# EAGLE design rpi breakout (EAGLE 9.3.0)
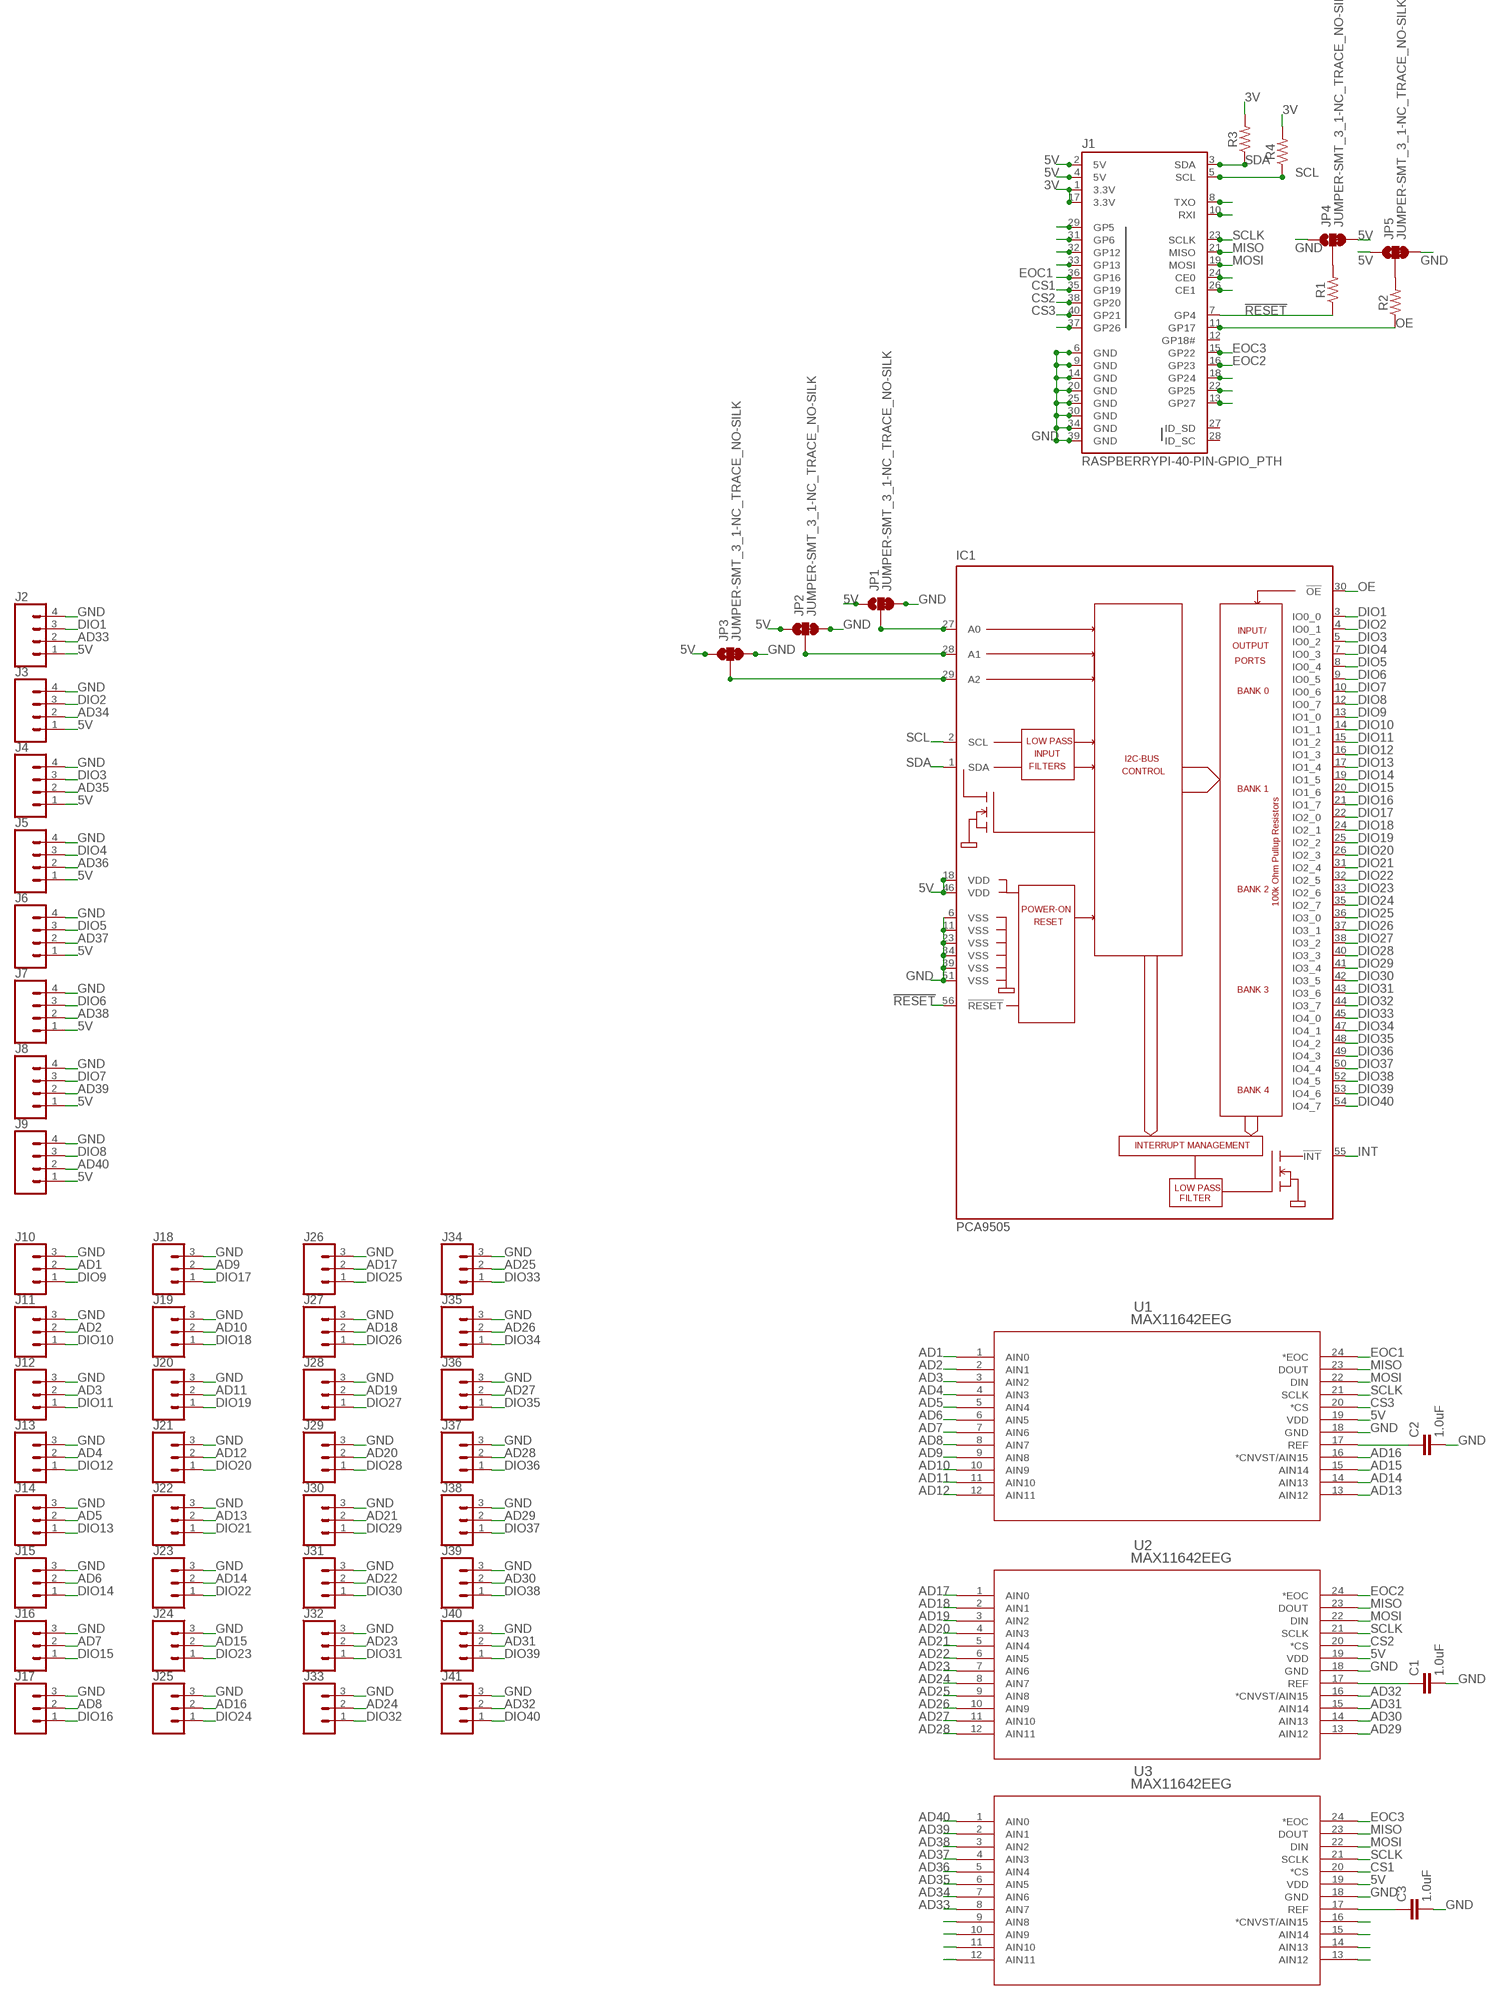
[diagram p0: schematic, sheet 1]

## Parts
C1  1.0uF  1.0UF-0805-25V-10%  [0805]
C2  1.0uF  1.0UF-0805-25V-10%  [0805]
C3  1.0uF  1.0UF-0805-25V-10%  [0805]
IC1  PCA9505  [TSSOP56-6]
J1  RASPBERRYPI-40-PIN-GPIO_PTH  [2X20_SHROUDED]
J2  CONN_04JST-PTH  [JST-4-PTH]
J3  CONN_04JST-PTH  [JST-4-PTH]
J4  CONN_04JST-PTH  [JST-4-PTH]
J5  CONN_04JST-PTH  [JST-4-PTH]
J6  CONN_04JST-PTH  [JST-4-PTH]
J7  CONN_04JST-PTH  [JST-4-PTH]
J8  CONN_04JST-PTH  [JST-4-PTH]
J9  CONN_04JST-PTH  [JST-4-PTH]
J10  CONN_03JST-PTH  [JST-3-PTH]
J11  CONN_03JST-PTH  [JST-3-PTH]
J12  CONN_03JST-PTH  [JST-3-PTH]
J13  CONN_03JST-PTH  [JST-3-PTH]
J14  CONN_03JST-PTH  [JST-3-PTH]
J15  CONN_03JST-PTH  [JST-3-PTH]
J16  CONN_03JST-PTH  [JST-3-PTH]
J17  CONN_03JST-PTH  [JST-3-PTH]
J18  CONN_03JST-PTH  [JST-3-PTH]
J19  CONN_03JST-PTH  [JST-3-PTH]
J20  CONN_03JST-PTH  [JST-3-PTH]
J21  CONN_03JST-PTH  [JST-3-PTH]
J22  CONN_03JST-PTH  [JST-3-PTH]
J23  CONN_03JST-PTH  [JST-3-PTH]
J24  CONN_03JST-PTH  [JST-3-PTH]
J25  CONN_03JST-PTH  [JST-3-PTH]
J26  CONN_03JST-PTH  [JST-3-PTH]
J27  CONN_03JST-PTH  [JST-3-PTH]
J28  CONN_03JST-PTH  [JST-3-PTH]
J29  CONN_03JST-PTH  [JST-3-PTH]
J30  CONN_03JST-PTH  [JST-3-PTH]
J31  CONN_03JST-PTH  [JST-3-PTH]
J32  CONN_03JST-PTH  [JST-3-PTH]
J33  CONN_03JST-PTH  [JST-3-PTH]
J34  CONN_03JST-PTH  [JST-3-PTH]
J35  CONN_03JST-PTH  [JST-3-PTH]
J36  CONN_03JST-PTH  [JST-3-PTH]
J37  CONN_03JST-PTH  [JST-3-PTH]
J38  CONN_03JST-PTH  [JST-3-PTH]
J39  CONN_03JST-PTH  [JST-3-PTH]
J40  CONN_03JST-PTH  [JST-3-PTH]
J41  CONN_03JST-PTH  [JST-3-PTH]
JP1  JUMPER-SMT_3_1-NC_TRACE_NO-SILK  [SMT-JUMPER_3_1-NC_TRACE_NO-SILK]
JP2  JUMPER-SMT_3_1-NC_TRACE_NO-SILK  [SMT-JUMPER_3_1-NC_TRACE_NO-SILK]
JP3  JUMPER-SMT_3_1-NC_TRACE_NO-SILK  [SMT-JUMPER_3_1-NC_TRACE_NO-SILK]
JP4  JUMPER-SMT_3_1-NC_TRACE_NO-SILK  [SMT-JUMPER_3_1-NC_TRACE_NO-SILK]
JP5  JUMPER-SMT_3_1-NC_TRACE_NO-SILK  [SMT-JUMPER_3_1-NC_TRACE_NO-SILK]
R1  RESISTOR0805  [0805]
R2  RESISTOR0805  [0805]
R3  RESISTOR0805  [0805]
R4  RESISTOR0805  [0805]
U1  MAX11642EEG  [21-0055H_24]
U2  MAX11642EEG  [21-0055H_24]
U3  MAX11642EEG  [21-0055H_24]

## Nets
3V: J1.1(3.3V) J1.17(3.3V) R3.2 R4.2
5V: IC1.18(VDD) IC1.46(VDD) J1.2(5V) J1.4(5V) J2.1 J3.1 J4.1 J5.1 J6.1 J7.1 J8.1 J9.1 JP1.1 JP2.1 JP3.1 JP4.3 JP5.1 U1.19(VDD) U2.19(VDD) U3.19(VDD)
!RESET: IC1.56(!RESET) J1.7(GP4) R1.1
AD1: J10.2 U1.1(AIN0)
AD2: J11.2 U1.2(AIN1)
AD3: J12.2 U1.3(AIN2)
AD4: J13.2 U1.4(AIN3)
AD5: J14.2 U1.5(AIN4)
AD6: J15.2 U1.6(AIN5)
AD7: J16.2 U1.7(AIN6)
AD8: J17.2 U1.8(AIN7)
AD9: J18.2 U1.9(AIN8)
AD10: J19.2 U1.10(AIN9)
AD11: J20.2 U1.11(AIN10)
AD12: J21.2 U1.12(AIN11)
AD13: J22.2 U1.13(AIN12)
AD14: J23.2 U1.14(AIN13)
AD15: J24.2 U1.15(AIN14)
AD16: J25.2 U1.16(*CNVST/AIN15)
AD17: J26.2 U2.1(AIN0)
AD18: J27.2 U2.2(AIN1)
AD19: J28.2 U2.3(AIN2)
AD20: J29.2 U2.4(AIN3)
AD21: J30.2 U2.5(AIN4)
AD22: J31.2 U2.6(AIN5)
AD23: J32.2 U2.7(AIN6)
AD24: J33.2 U2.8(AIN7)
AD25: J34.2 U2.9(AIN8)
AD26: J35.2 U2.10(AIN9)
AD27: J36.2 U2.11(AIN10)
AD28: J37.2 U2.12(AIN11)
AD29: J38.2 U2.13(AIN12)
AD30: J39.2 U2.14(AIN13)
AD31: J40.2 U2.15(AIN14)
AD32: J41.2 U2.16(*CNVST/AIN15)
AD33: J2.2 U3.8(AIN7)
AD34: J3.2 U3.7(AIN6)
AD35: J4.2 U3.6(AIN5)
AD36: J5.2 U3.5(AIN4)
AD37: J6.2 U3.4(AIN3)
AD38: J7.2 U3.3(AIN2)
AD39: J8.2 U3.2(AIN1)
AD40: J9.2 U3.1(AIN0)
CS1: J1.35(GP19) U3.20(*CS)
CS2: J1.38(GP20) U2.20(*CS)
CS3: J1.40(GP21) U1.20(*CS)
DIO1: IC1.3(IO0_0) J2.3
DIO2: IC1.4(IO0_1) J3.3
DIO3: IC1.5(IO0_2) J4.3
DIO4: IC1.7(IO0_3) J5.3
DIO5: IC1.8(IO0_4) J6.3
DIO6: IC1.9(IO0_5) J7.3
DIO7: IC1.10(IO0_6) J8.3
DIO8: IC1.12(IO0_7) J9.3
DIO9: IC1.13(IO1_0) J10.1
DIO10: IC1.14(IO1_1) J11.1
DIO11: IC1.15(IO1_2) J12.1
DIO12: IC1.16(IO1_3) J13.1
DIO13: IC1.17(IO1_4) J14.1
DIO14: IC1.19(IO1_5) J15.1
DIO15: IC1.20(IO1_6) J16.1
DIO16: IC1.21(IO1_7) J17.1
DIO17: IC1.22(IO2_0) J18.1
DIO18: IC1.24(IO2_1) J19.1
DIO19: IC1.25(IO2_2) J20.1
DIO20: IC1.26(IO2_3) J21.1
DIO21: IC1.31(IO2_4) J22.1
DIO22: IC1.32(IO2_5) J23.1
DIO23: IC1.33(IO2_6) J24.1
DIO24: IC1.35(IO2_7) J25.1
DIO25: IC1.36(IO3_0) J26.1
DIO26: IC1.37(IO3_1) J27.1
DIO27: IC1.38(IO3_2) J28.1
DIO28: IC1.40(IO3_3) J29.1
DIO29: IC1.41(IO3_4) J30.1
DIO30: IC1.42(IO3_5) J31.1
DIO31: IC1.43(IO3_6) J32.1
DIO32: IC1.44(IO3_7) J33.1
DIO33: IC1.45(IO4_0) J34.1
DIO34: IC1.47(IO4_1) J35.1
DIO35: IC1.48(IO4_2) J36.1
DIO36: IC1.49(IO4_3) J37.1
DIO37: IC1.50(IO4_4) J38.1
DIO38: IC1.52(IO4_5) J39.1
DIO39: IC1.53(IO4_6) J40.1
DIO40: IC1.54(IO4_7) J41.1
EOC1: J1.36(GP16) U1.24(*EOC)
EOC2: J1.16(GP23) U2.24(*EOC)
EOC3: J1.15(GP22) U3.24(*EOC)
GND: C1.2 C2.2 C3.2 IC1.6(VSS) IC1.11(VSS) IC1.23(VSS) IC1.34(VSS) IC1.39(VSS) IC1.51(VSS) J1.6(GND) J1.9(GND) J1.14(GND) J1.20(GND) J1.25(GND) J1.30(GND) J1.34(GND) J1.39(GND) J2.4 J3.4 J4.4 J5.4 J6.4 J7.4 J8.4 J9.4 J10.3 J11.3 J12.3 J13.3 J14.3 J15.3 J16.3 J17.3 J18.3 J19.3 J20.3 J21.3 J22.3 J23.3 J24.3 J25.3 J26.3 J27.3 J28.3 J29.3 J30.3 J31.3 J32.3 J33.3 J34.3 J35.3 J36.3 J37.3 J38.3 J39.3 J40.3 J41.3 JP1.3 JP2.3 JP3.3 JP4.1 JP5.3 U1.18(GND) U2.18(GND) U3.18(GND)
INT: IC1.55(!INT)
MISO: J1.21(MISO) U1.23(DOUT) U2.23(DOUT) U3.23(DOUT)
MOSI: J1.19(MOSI) U1.22(DIN) U2.22(DIN) U3.22(DIN)
N$1: JP4.2 R1.2
N$2: C3.1 U3.17(REF)
N$3: C1.1 U2.17(REF)
N$4: JP5.2 R2.2
N$5: J1.29(GP5)
N$6: J1.31(GP6)
N$7: J1.32(GP12)
N$8: J1.33(GP13)
N$11: C2.1 U1.17(REF)
N$13: J1.37(GP26)
N$17: IC1.27(A0) JP1.2
N$18: IC1.28(A1) JP2.2
N$19: IC1.29(A2) JP3.2
N$24: J1.8(TXO)
N$25: J1.10(RXI)
N$29: J1.24(CE0)
N$30: J1.26(CE1)
N$36: J1.18(GP24)
N$37: J1.22(GP25)
N$40: U3.9(AIN8)
N$41: U3.10(AIN9)
N$42: U3.11(AIN10)
N$43: U3.12(AIN11)
N$52: U3.16(*CNVST/AIN15)
N$53: U3.14(AIN13)
N$54: U3.15(AIN14)
N$55: U3.13(AIN12)
OE: IC1.30(!OE) J1.11(GP17) R2.1
SCL: IC1.2(SCL) J1.5(SCL) R4.1
SCLK: J1.23(SCLK) U1.21(SCLK) U2.21(SCLK) U3.21(SCLK)
SDA: IC1.1(SDA) J1.3(SDA) R3.1
SDA1: J1.13(GP27)
Unconnected: J1.12(GP18#) J1.27(ID_SD) J1.28(ID_SC)

## Library data of the parts
C1-C3 = SparkFun-Capacitors:1.0UF: 1µF ceramic capacitors A capacitor is a passive two-terminal electrical component used to store electrical energy temporarily in an electric field.; PROD_ID: CAP-08064
IC1 = micro-philips:PCA9505: 40-bit I2C-bus I/O port with /RESET, /OE and /INT The 9505 has 100k ohm pull-ups on IO pins. Source: http://www.nxp.com/acrobat_download/datasheets/PCA9505_9506_3.pdf; MPN: PCA9505DGG,118; OC_FARNELL: unknown; OC_NEWARK: 70R6450
J1 = SparkFun-Connectors:RASPBERRYPI-40-PIN-GPIO: Raspberry Pi GPIO Header 2x20 pin connector, as found on B, B+, A+ models. Both shrouded PTH and SMT versions available. SparkFun Products: GPIO Shrouded Header <https://www.sparkfun.com/products/13054>- PTH SparkFun Pi Wedge (Preassembled) <https://www.sparkfun.com/products/13717>; PROD_ID: CONN-12263; SF_ID: PRT-13054
J2-J9 = SparkFun-Connectors:CONN_04: Multi connection point. Often used as Generic Header-pin footprint for 0.1 inch spaced/style header connections On any of the 0.1 inch spaced packages, you can populate with these: Break Away Headers - Straight <https://www.sparkfun.com/products/116> (PRT-00116) Break Away Male Headers - Right Angle <https://www.sparkfun.com/products/553> (PRT-00553) Female Headers <https://www.sparkfun.com/products/115> (PRT-00115) Break Away Headers - Machine Pin <https://www.sparkfun.com/products/117> (PRT-00117) Break Away Female Headers - Swiss Machine Pin <https://www.sparkfun.com/products/743> (PRT-00743) For SCREWTERMINALS and SPRING TERMINALS visit here: Screw Terimnals on SparkFun.com <https://www.sparkfun.com/search/results?term=Screw+Terminals> (5mm/3.5mm/2.54mm spacing) This device is also useful as a general connection point to wire up your design to another part of your project. Our various solder wires solder well into these plated through hole pads. Hook-Up Wire - Assortment (Stranded, 22 AWG) <https://www.sparkfun.com/products/11375> (PRT-11375) Hook-Up Wire - Assortment (Solid Core, 22 AWG) <https://www.sparkfun.com/products/11367> (PRT-11367) View the entire wire category on our website here <https://www.sparkfun.com/categories/141> Special notes: Molex polarized connector foot print use with SKU : PRT-08231 with associated crimp pins and housings. 1MM SMD Version SKU: PRT-10208; PROD_ID: WIRE-13531; SF_ID: PRT-09916
J10-J41 = SparkFun-Connectors:CONN_03: Multi connection point. Often used as Generic Header-pin footprint for 0.1 inch spaced/style header connections On any of the 0.1 inch spaced packages, you can populate with these: Break Away Headers - Straight <https://www.sparkfun.com/products/116> (PRT-00116) Break Away Male Headers - Right Angle <https://www.sparkfun.com/products/553> (PRT-00553) Female Headers <https://www.sparkfun.com/products/115> (PRT-00115) Break Away Headers - Machine Pin <https://www.sparkfun.com/products/117> (PRT-00117) Break Away Female Headers - Swiss Machine Pin <https://www.sparkfun.com/products/743> (PRT-00743) Stackable Header - 3 Pin (Female, 0.1") <https://www.sparkfun.com/products/13875> (PRT-13875) For SCREWTERMINALS and SPRING TERMINALS visit here: Screw Terimnals on SparkFun.com <https://www.sparkfun.com/search/results?term=Screw+Terminals> (5mm/3.5mm/2.54mm spacing) This device is also useful as a general connection point to wire up your design to another part of your project. Our various solder wires solder well into these plated through hole pads. Hook-Up Wire - Assortment (Stranded, 22 AWG) <https://www.sparkfun.com/products/11375> (PRT-11375) Hook-Up Wire - Assortment (Solid Core, 22 AWG) <https://www.sparkfun.com/products/11367> (PRT-11367) View the entire wire category on our website here <https://www.sparkfun.com/categories/141> Special notes: Molex polarized connector foot print use with SKU : PRT-08232 with associated crimp pins and housings.; PROD_ID: WIRE-10037; SF_ID: PRT-09915
JP1-JP5 = SparkFun-Jumpers:JUMPER-SMT_3_1-NC_TRACE: Normally closed trace jumper (1 of 2 connections) This jumper has a trace between two pads so it's normally closed (NC). The other connection is normally open (NO). Use a razor knife to open the connection. For best results follow the IPC guidelines for cutting traces: Cutout at least 0.063 mm (0.005 in). Remove all loose material to clean up the cut area. Seal the cut with an approved epoxy. Reapply solder to reclose the connection, or to close the NO connection.
R1-R4 = SparkFun-Resistors:RESISTOR: Generic Resistor Package
U1-U3 = MAX11642EEG:MAX11642EEG; AVAILABILITY: Unavailable; DESCRIPTION: ADC Single SAR 300ksps 8-bit Serial 24-Pin QSOP T/R; MF: Maxim Integrated; MP: MAX11642EEG+T; PACKAGE: QSOP-24 Maxim Integrated; PRICE: None

## Board
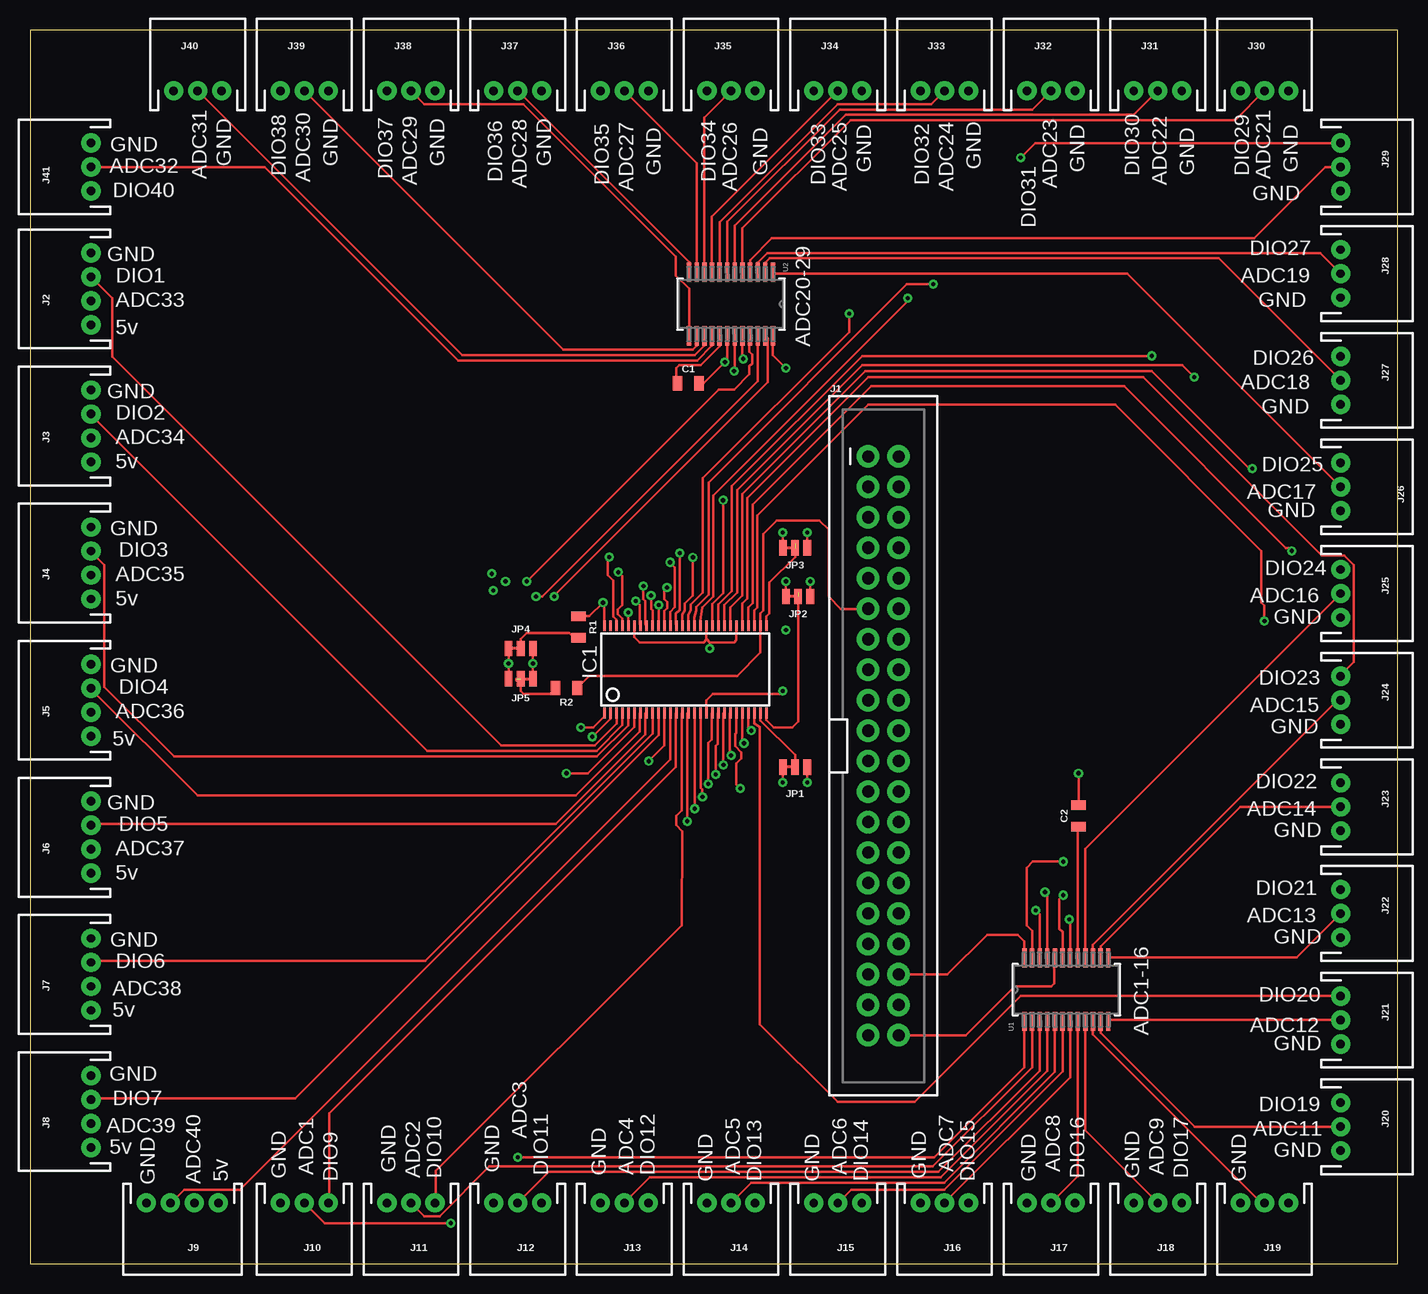
[diagram p1: board, top side]
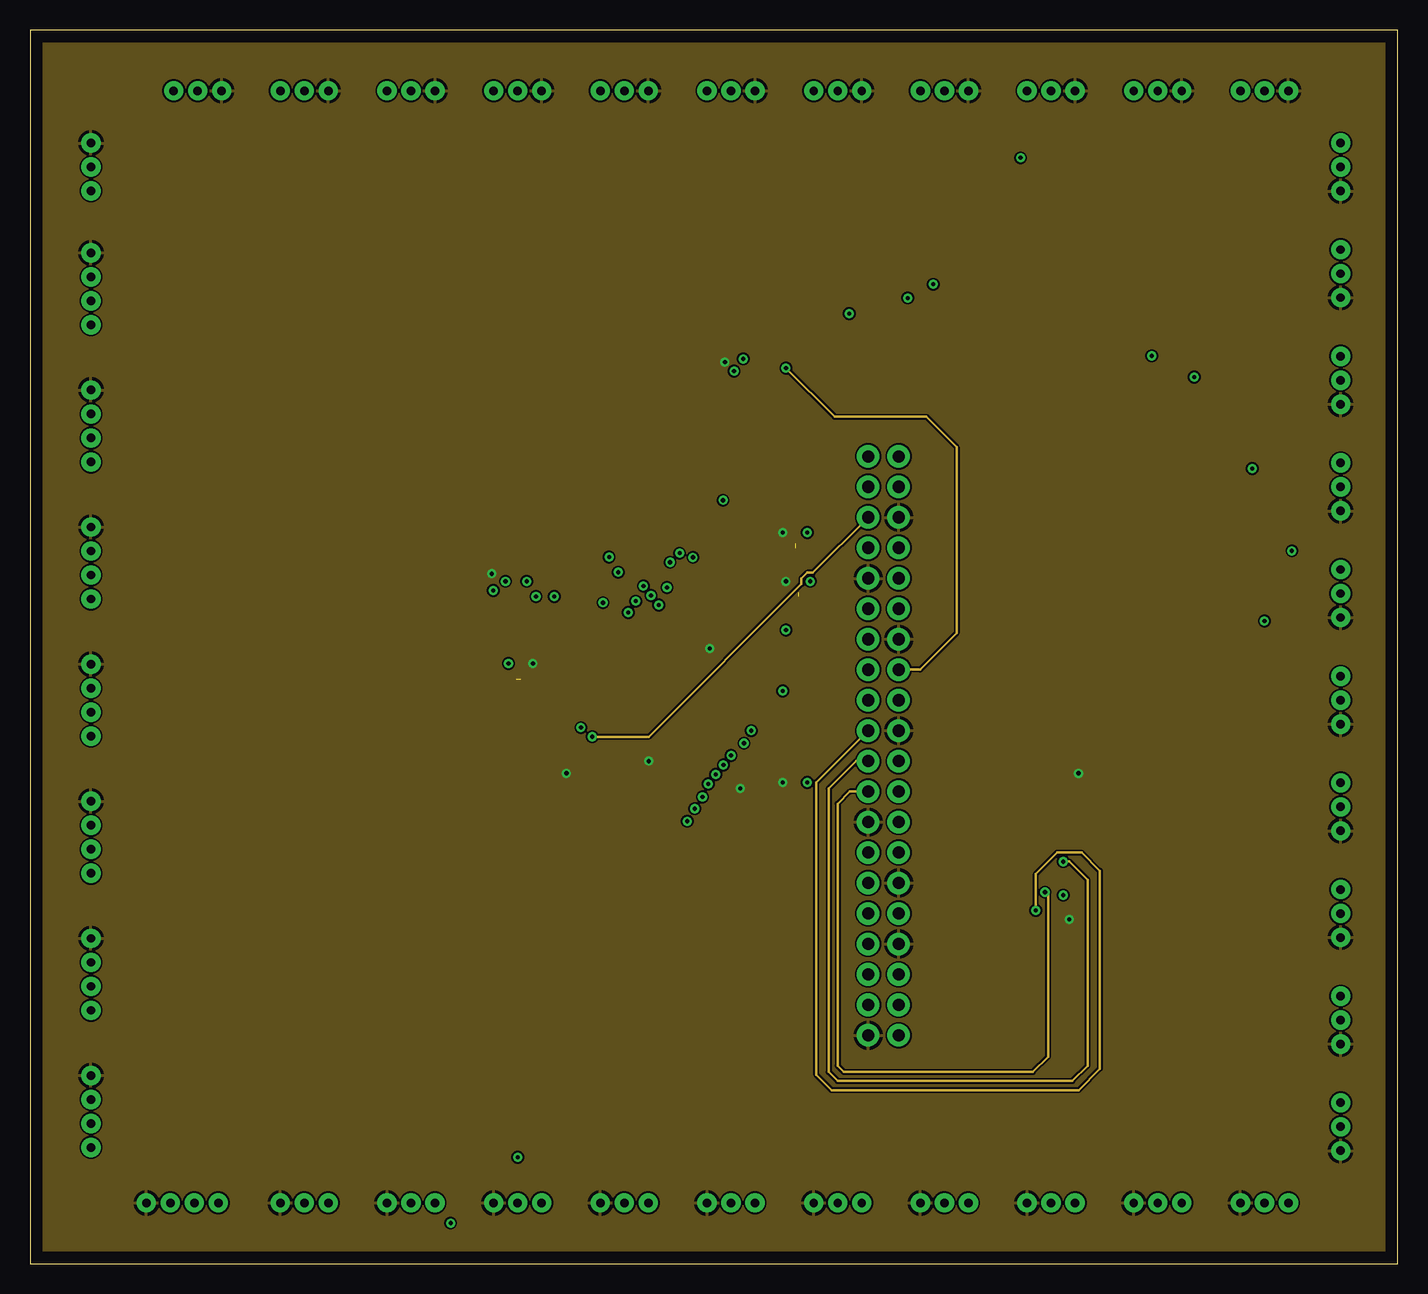
[diagram p2: board, inner layer Route2]
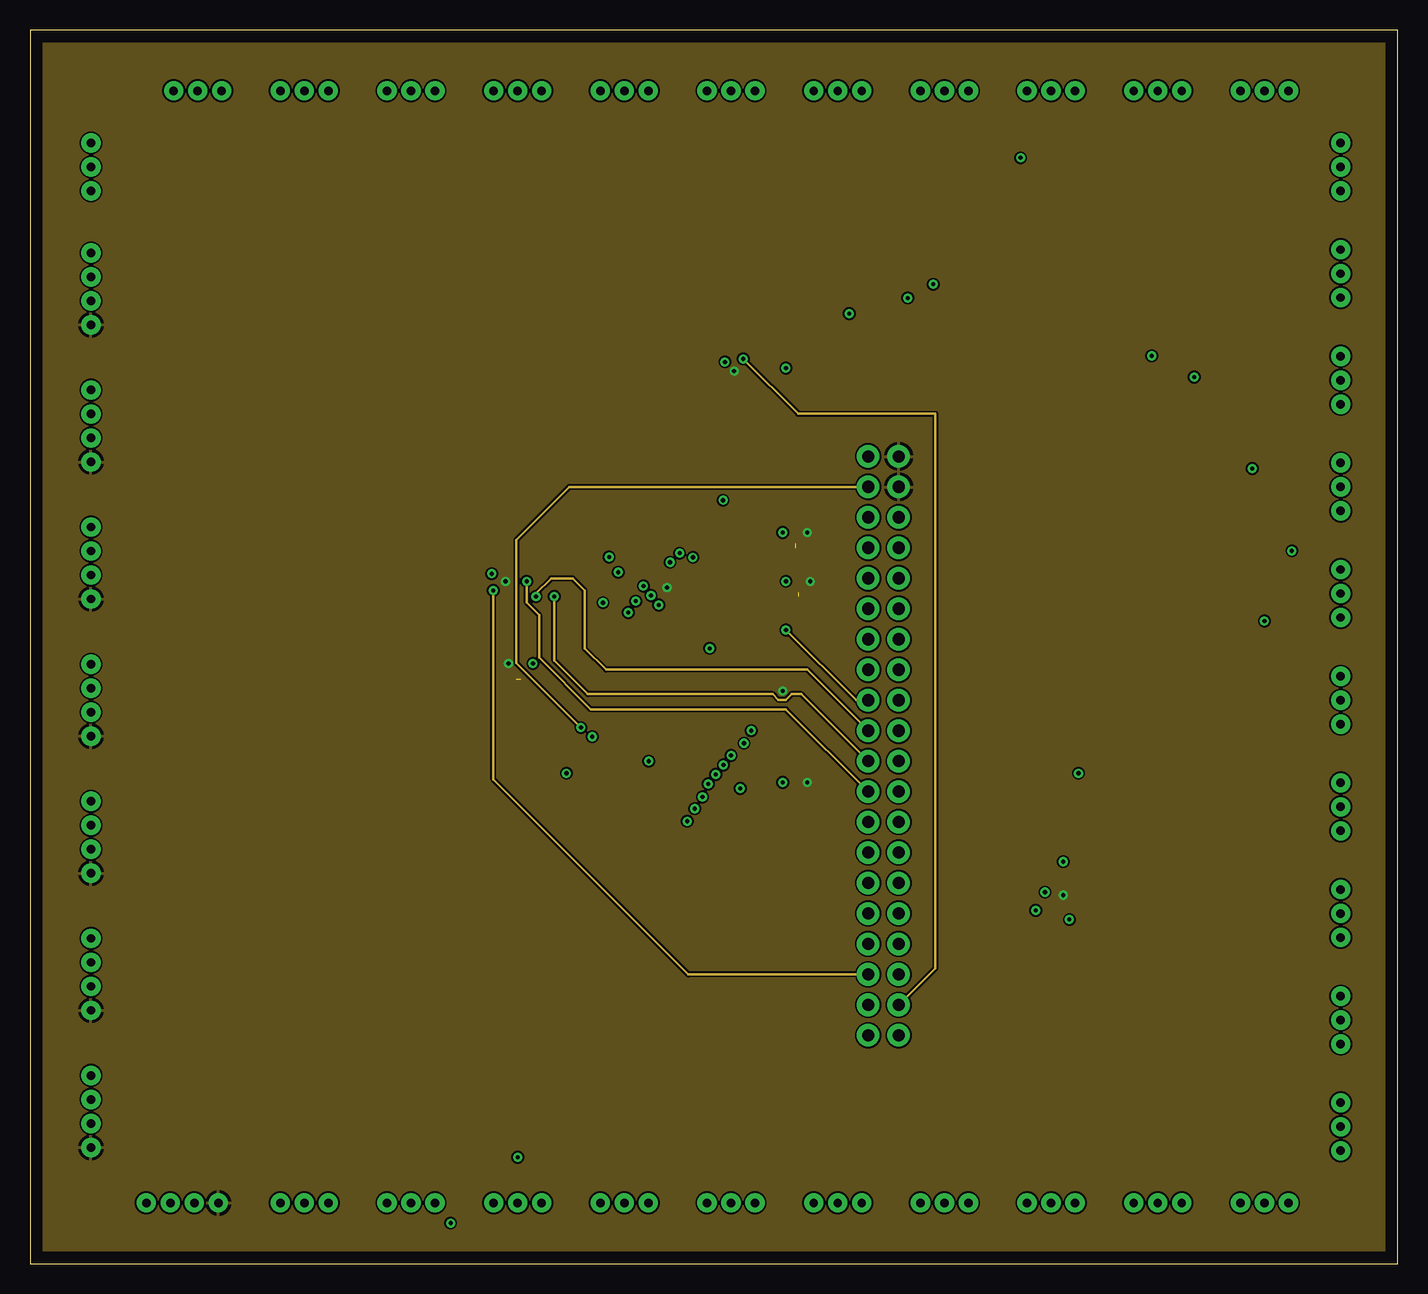
[diagram p3: board, inner layer Route15]
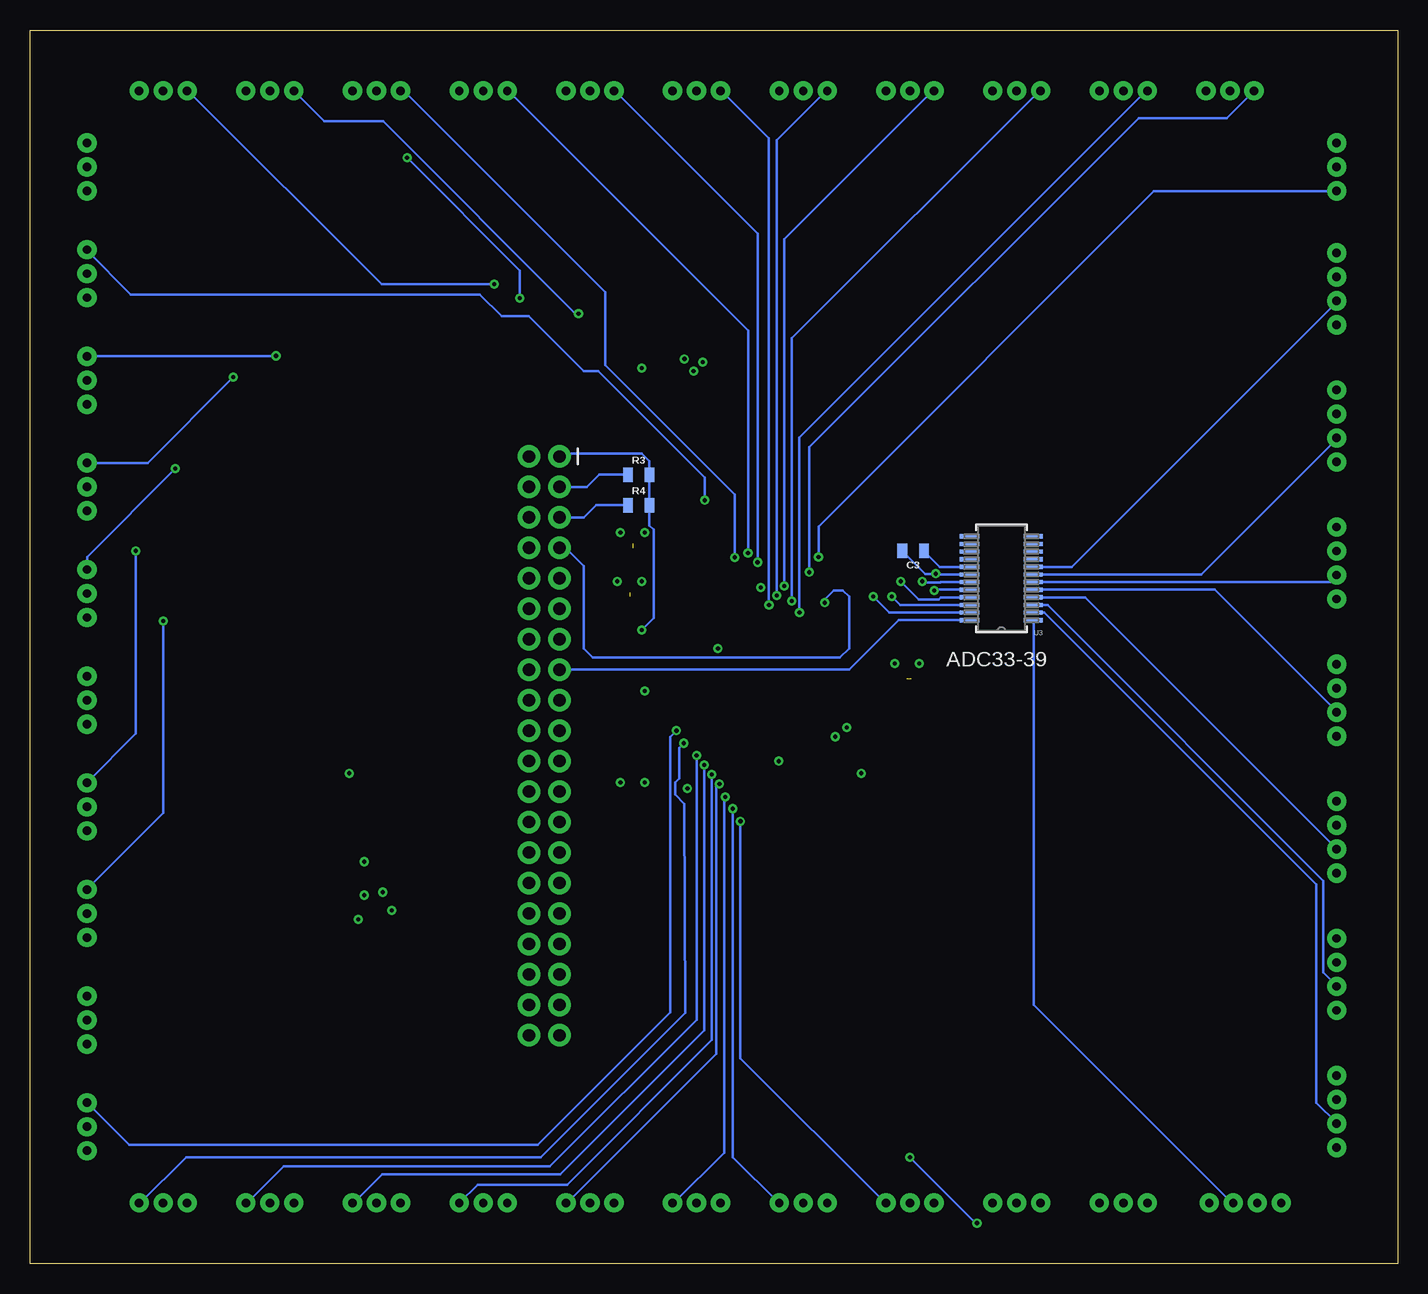
[diagram p4: board, bottom side, seen from below]

Size 113.97 x 102.86 mm. Coordinates in mm from the lower left corner, seen from the top.
Outline: 0,0 113.97,0 113.97,102.86 0,102.86 0,0
Copper layers (1+2*15+16): Top 0.035mm / dielectric 1.5mm / Route2 0.035mm / dielectric 0.15mm / Route15 0.035mm / dielectric 0.2mm / Bottom 0.035mm
Design rules "default *": minimum track width 6mil, minimum drill 0.35mm, track to track 6mil, track to pad 6mil, pad to pad 6mil, via to via 6mil, smd to smd 6mil, copper to edge 40mil, drill to drill 6mil, minimum pad ring 10mil, minimum via ring 8mil, stop-mask expansion 4mil, vias tented up to drill 0mil, thermal gap 10mil

### Footprints (pad centres in the part's own frame; a part is rotated, then mirrored left to right if it is on the bottom)
0805 = smd 0.8 x 1.2: 1 -0.9,0; 2 0.9,0
TSSOP56-6 = smd 0.2 x 0.9: 1 -6.75,-3.6; 2 -6.25,-3.6; 3 -5.75,-3.6; 4 -5.25,-3.6; 5 -4.75,-3.6; 6 -4.25,-3.6; 7 -3.75,-3.6; 8 -3.25,-3.6; 9 -2.75,-3.6; 10 -2.25,-3.6; 11 -1.75,-3.6; 12 -1.25,-3.6; 13 -0.75,-3.6; 14 -0.25,-3.6; 15 0.25,-3.6; 16 0.75,-3.6; 17 1.25,-3.6; 18 1.75,-3.6; 19 2.25,-3.6; 20 2.75,-3.6; 21 3.25,-3.6; 22 3.75,-3.6; 23 4.25,-3.6; 24 4.75,-3.6; 25 5.25,-3.6; 26 5.75,-3.6; 27 6.25,-3.6; 28 6.75,-3.6; 29 6.75,3.66; 30 6.25,3.66; 31 5.75,3.66; 32 5.25,3.66; 33 4.75,3.66; 34 4.25,3.66; 35 3.75,3.66; 36 3.25,3.66; 37 2.75,3.66; 38 2.25,3.66; 39 1.75,3.66; 40 1.25,3.66; 41 0.75,3.66; 42 0.25,3.66; 43 -0.25,3.66; 44 -0.75,3.66; 45 -1.25,3.66; 46 -1.75,3.66; 47 -2.25,3.66; 48 -2.75,3.66; 49 -3.25,3.66; 50 -3.75,3.66; 51 -4.25,3.66; 52 -4.75,3.66; 53 -5.25,3.66; 54 -5.75,3.66; 55 -6.25,3.66; 56 -6.75,3.66
2X20_SHROUDED = drill 1.016 pad 1.88: 1 -1.27,24.13; 2 1.27,24.13; 3 -1.27,21.59; 4 1.27,21.59; 5 -1.27,19.05; 6 1.27,19.05; 7 -1.27,16.51; 8 1.27,16.51; 9 -1.27,13.97; 10 1.27,13.97; 11 -1.27,11.43; 12 1.27,11.43; 13 -1.27,8.89; 14 1.27,8.89; 15 -1.27,6.35; 16 1.27,6.35; 17 -1.27,3.81; 18 1.27,3.81; 19 -1.27,1.27; 20 1.27,1.27; 21 -1.27,-1.27; 22 1.27,-1.27; 23 -1.27,-3.81; 24 1.27,-3.81; 25 -1.27,-6.35; 26 1.27,-6.35; 27 -1.27,-8.89; 28 1.27,-8.89; 29 -1.27,-11.43; 30 1.27,-11.43; 31 -1.27,-13.97; 32 1.27,-13.97; 33 -1.27,-16.51; 34 1.27,-16.51; 35 -1.27,-19.05; 36 1.27,-19.05; 37 -1.27,-21.59; 38 1.27,-21.59; 39 -1.27,-24.13; 40 1.27,-24.13
JST-4-PTH = drill 0.7 pad 1.6: 1 -3,0; 2 -1,0; 3 1,0; 4 3,0
JST-3-PTH = drill 0.7 pad 1.6: 1 -2,0; 2 0,0; 3 2,0
SMT-JUMPER_3_1-NC_TRACE_NO-SILK = smd 0.635 x 1.27: 1 -1.016,0; 2 0,0; 3 1.016,0
21-0055H_24 = smd 1.6 x 0.356: 1 -2.654,3.493; 2 -2.654,2.857; 3 -2.654,2.223; 4 -2.654,1.587; 5 -2.654,0.953; 6 -2.654,0.318; 7 -2.654,-0.318; 8 -2.654,-0.953; 9 -2.654,-1.587; 10 -2.654,-2.223; 11 -2.654,-2.857; 12 -2.654,-3.493; 13 2.654,-3.493; 14 2.654,-2.857; 15 2.654,-2.223; 16 2.654,-1.587; 17 2.654,-0.953; 18 2.654,-0.318; 19 2.654,0.318; 20 2.654,0.953; 21 2.654,1.587; 22 2.654,2.223; 23 2.654,2.857; 24 2.654,3.493

### Placement (x,y rotation side)
C1  54.86,73.41 0 top
C2  87.38,37.34 90 top
C3  40.39,59.44 180 bottom
IC1  54.61,49.53 0 top
J1  71.12,43.18 0 top
J2  5.08,81.28 90 top
J3  5.08,69.85 90 top
J4  5.08,58.42 90 top
J5  5.08,46.99 90 top
J6  5.08,35.56 90 top
J7  5.08,24.13 90 top
J8  5.08,12.7 90 top
J9  12.7,5.08 180 top
J10  22.86,5.08 180 top
J11  31.75,5.08 180 top
J12  40.64,5.08 180 top
J13  49.53,5.08 180 top
J14  58.42,5.08 180 top
J15  67.31,5.08 180 top
J16  76.2,5.08 180 top
J17  85.09,5.08 180 top
J18  93.98,5.08 180 top
J19  102.87,5.08 180 top
J20  109.22,11.43 270 top
J21  109.22,20.32 270 top
J22  109.22,29.21 270 top
J23  109.22,38.1 270 top
J24  109.22,46.99 270 top
J25  109.22,55.88 270 top
J26  109.22,64.77 270 top
J27  109.22,73.66 270 top
J28  109.22,82.55 270 top
J29  109.22,91.44 270 top
J30  102.87,97.79 0 top
J31  93.98,97.79 0 top
J32  85.09,97.79 0 top
J33  76.2,97.79 0 top
J34  67.31,97.79 0 top
J35  58.42,97.79 0 top
J36  49.53,97.79 0 top
J37  40.64,97.79 0 top
J38  31.75,97.79 0 top
J39  22.86,97.79 0 top
J40  13.97,97.79 0 top
J41  5.08,91.44 90 top
JP1  63.75,41.4 180 top
JP2  64.01,55.63 180 top
JP3  63.75,59.69 180 top
JP4  40.89,51.31 180 top
JP5  40.89,48.77 0 top
R1  45.72,53.09 270 top
R2  44.7,48.01 180 top
R3  63.25,65.79 0 bottom
R4  63.25,63.25 0 bottom
U1  86.36,22.86 90 top
U2  58.42,80.01 270 top
U3  33.02,57.15 180 bottom

### Tracks (layer width: path | path; a pad name or v marks a point on that pad's centre or on a via)
3V  (via drill 0.35)
  Route15 0.203: v62.99,52.83 68.83,46.99 J1.17
  Bottom 0.203: J1.1 69.6,67.56 62.99,67.56 62.35,66.92 R3.2 R4.2 62.35,61.55 62,61.21 62,53.82 v62.99,52.83
5V  (via drill 0.35)
  Top 0.152: 56.36,46.04 56.36,45.97 | 56.36,45.97 IC1.18 | 56.39,46 56.36,45.97
  Top 0.203: IC1.46 52.86,54.41 53.12,54.68 53.12,55.18 52.86,55.44 52.86,56.16 v53.09,56.39 | JP1.1 v64.77,40.13 | JP2.1 v65.02,56.9 | JP3.1 v64.77,60.96 | U1.19 86.04,27.65 85.75,27.94 85.75,30.38 v86.11,30.73 | U2.19 58.74,74.49 v58.67,74.42 | IC1.18 56.36,46.96 56.9,47.5 62.48,47.5 v62.74,47.75 | JP4.3 v39.88,50.04 JP5.1
  Bottom 0.203: U3.19 38.07,56.83 38.1,56.8 39.52,56.8 v39.62,56.9
  pour Route15: 0,102.87 114.3,102.87 114.3,0 0,0
!RESET  (via drill 0.35)
  Top 0.203: IC1.56 47.86,55.01 v47.75,55.12 46.62,53.99 R1.1
  Bottom 0.203: v47.75,55.12 47.75,55.37 46.99,56.13 46.23,56.13 45.72,55.63 45.72,51.31 46.48,50.55 67.06,50.55 67.82,51.31 67.82,58.17 69.34,59.69 J1.7
AD1  (via drill 0.35)
  Top 0.203: U1.1 82.87,16.4 75.36,8.89 v40.64,8.89 40.55,8.89 | v35.05,3.4 24.54,3.4 J10.2
  Bottom 0.203: v35.05,3.4 35.15,3.4 v40.64,8.89
AD2
  Top 0.203: U1.2 83.5,16.4 75.23,8.13 38.29,8.13 34.13,3.97 32.86,3.97 J11.2
AD3
  Top 0.203: U1.3 84.14,16.1 75.69,7.65 43.21,7.65 J12.2
AD4
  Top 0.203: U1.4 84.77,16.1 75.88,7.21 51.66,7.21 J13.2
AD5
  Top 0.203: U1.5 85.41,16 76.17,6.76 60.1,6.76 J14.2
AD6
  Top 0.203: U1.6 86.04,16.03 76.2,6.19 68.42,6.19 J15.2
AD7
  Top 0.203: U1.7 86.68,15.56 J16.2
AD8
  Top 0.203: U1.8 87.31,7.3 J17.2
AD9
  Top 0.203: U1.9 87.95,11.11 J18.2
AD10
  Top 0.203: U1.10 88.58,19.11 102.62,5.08 J19.2
AD11
  Top 0.203: U1.11 89.22,19.27 97.06,11.43 J20.2
AD12
  Top 0.203: J21.2 89.85,20.32 U1.12
AD13
  Top 0.203: J22.2 105.57,25.56 89.85,25.56 U1.13
AD14
  Top 0.203: U1.14 89.22,26.45 100.87,38.1 J23.2
AD15
  Top 0.203: U1.15 88.58,26.61 108.97,46.99 J24.2
AD16
  Top 0.203: U1.16 87.95,34.61 J25.2
AD17
  Top 0.203: J26.2 91.44,82.55 61.91,82.55 U2.1
AD18
  Top 0.203: U2.2 61.28,83.47 61.63,83.82 99.06,83.82 J27.2
AD19
  Top 0.203: U2.3 60.64,83.47 61.44,84.26 107.5,84.26 J28.2
AD20
  Top 0.203: U2.4 60.01,83.68 61.83,85.5 102.01,85.5 107.95,91.44 J29.2
AD21
  Top 0.203: U2.5 59.37,86.33 68.39,95.34 100.42,95.34 J30.2
AD22
  Top 0.203: U2.6 58.74,86.55 67.98,95.79 91.98,95.79 J31.2
AD23
  Top 0.203: U2.7 58.1,86.87 67.47,96.23 83.53,96.23 J32.2
AD24
  Top 0.203: U2.8 57.47,86.84 67.31,96.68 75.09,96.68 J33.2
AD25
  Top 0.203: U2.9 56.83,87.31 J34.2
AD26
  Top 0.203: U2.10 56.2,95.57 J35.2
AD27
  Top 0.203: U2.11 55.56,91.76 J36.2
AD28
  Top 0.203: U2.12 54.93,83.5 J37.2
AD29
  Top 0.203: U2.13 54.93,81.28 53.82,82.39 53.82,83.98 41.12,96.68 32.86,96.68 J38.2
AD30
  Top 0.203: U2.14 55.56,76.55 55.21,76.2 44.45,76.2 J39.2
AD31
  Top 0.203: U2.15 56.2,76.55 55.4,75.75 36.01,75.75 J40.2
AD32
  Top 0.203: U2.16 56.83,76.55 55.59,75.31 35.69,75.31 19.56,91.44 J41.2
AD33
  Bottom 0.203: U3.8 27.15,58.1 5.08,80.17 J2.2
AD34
  Bottom 0.203: U3.7 16.35,57.47 5.08,68.74 J3.2
AD35
  Bottom 0.203: U3.6 5.56,56.83 5.08,57.31 J4.2
AD36
  Bottom 0.203: U3.5 15.24,56.2 5.08,46.04 J5.2
AD37
  Bottom 0.203: U3.4 26.04,55.56 5.08,34.61 J6.2
AD38
  Bottom 0.203: U3.3 29.18,54.93 6.19,31.94 6.19,24.29 5.08,23.18 J7.2
AD39
  Bottom 0.203: U3.2 29.43,54.29 6.76,31.62 6.76,13.43 5.08,11.75 J8.2
AD40
  Bottom 0.203: U3.1 30.32,53.66 30.32,21.59 13.81,5.08 J9.2
CS1  (via drill 0.35)
  Route15 0.203: J1.35 54.86,24.13 38.61,40.39 v38.61,56.13
  Bottom 0.203: U3.20 38.54,56.2 v38.61,56.13
CS2  (via drill 0.35)
  Top 0.203: U2.20 59.37,75.5 v59.44,75.44
  Route15 0.203: v59.44,75.44 64.01,70.87 75.44,70.87 75.44,24.64 J1.38
CS3
  Top 0.203: J1.40 77.98,19.05 82.04,23.11 85.09,23.11 85.34,23.37 85.34,25.45 U1.20
DIO1
  Top 0.203: IC1.3 48.9,45.88 48.9,45.05 47.05,43.21 39.27,43.21 6.86,75.63 6.86,80.5 J2.3
DIO2
  Top 0.203: IC1.4 49.37,45.88 49.37,44.93 47.21,42.77 33.12,42.77 5.08,70.8 J3.3
DIO3
  Top 0.203: IC1.5 49.85,45.88 49.85,44.9 47.24,42.29 12,42.29 6.19,48.1 6.19,58.26 5.08,59.37 J4.3
DIO4
  Top 0.203: IC1.7 50.8,45.88 50.8,44.39 45.47,39.05 13.97,39.05 5.08,47.94 J5.3
DIO5
  Top 0.203: IC1.8 51.28,45.88 51.28,44.13 43.81,36.67 5.08,36.67 J6.3
DIO6
  Top 0.203: IC1.9 51.91,45.88 51.91,44.23 32.92,25.24 5.08,25.24 J7.3
DIO7
  Top 0.203: IC1.10 52.39,45.88 52.39,44.1 22.1,13.81 5.08,13.81 J8.3
DIO8
  Top 0.203: IC1.12 53.34,45.88 53.34,42.04 17.49,6.19 12.86,6.19 11.75,5.08 J9.3
DIO9
  Top 0.203: IC1.13 53.82,45.88 53.82,41.43 24.92,12.54 24.92,5.08 J10.1
DIO10
  Top 0.203: IC1.14 54.29,45.88 54.29,37.78 53.85,37.34 53.85,36.58 54.36,36.07 54.29,28.23 33.81,7.75 33.81,5.08 J11.1
DIO11  (via drill 0.35)
  Top 0.203: v54.77,36.89 54.77,45.88 IC1.15
  Bottom 0.203: v54.77,36.89 54.77,17.14 42.7,5.08 J12.1
DIO12  (via drill 0.35)
  Top 0.203: v55.4,37.94 55.4,45.88 IC1.16
  Bottom 0.203: v55.4,37.94 55.4,8.89 51.59,5.08 J13.1
DIO13  (via drill 0.35)
  Top 0.203: v56.04,38.92 56.04,39.53 55.88,39.69 55.88,45.88 IC1.17
  Bottom 0.203: v56.04,38.92 56.04,38.61 56.13,38.51 56.13,9.27 60.33,5.08 J14.1
DIO14  (via drill 0.35)
  Top 0.203: v56.52,40.01 56.52,43.4 56.83,43.72 56.83,45.88 IC1.19
  Bottom 0.203: v56.52,40.01 56.77,39.75 56.77,17.53 69.22,5.08 J15.1
DIO15  (via drill 0.35)
  Top 0.203: v57.15,40.8 57.15,43.18 57.31,43.34 57.31,45.88 IC1.20
  Bottom 0.203: v57.15,40.8 57.15,18.67 69.22,6.6 76.68,6.6 J16.1
DIO16  (via drill 0.35)
  Top 0.203: v57.78,41.59 57.78,45.88 IC1.21
  Bottom 0.203: v57.78,41.59 57.78,19.46 69.79,7.46 84.61,7.46 87,5.08 J17.1
DIO17  (via drill 0.35)
  Top 0.203: v58.42,42.39 58.29,42.51 58.29,45.86 IC1.22
  Bottom 0.203: v58.42,42.39 58.42,20.35 70.64,8.13 92.84,8.13 95.89,5.08 J18.1
DIO18  (via drill 0.35)
  Top 0.203: v59.5,43.4 59.37,43.53 59.37,45.88 IC1.24
  Bottom 0.203: v59.5,43.4 59.88,43.02 59.88,40.45 60.2,40.13 60.2,39.12 59.44,38.35 59.37,20.92 71.41,8.89 100.97,8.89 104.78,5.08 J19.1
DIO19  (via drill 0.35)
  Top 0.203: IC1.25 59.86,44.94 59.85,44.92 59.85,44.7 v60.1,44.45
  Bottom 0.203: v60.1,44.45 60.61,43.94 60.61,20.95 71.66,9.91 105.7,9.91 J20.1
DIO20
  Top 0.203: J21.1 82.55,22.32 73.72,13.49 67.31,13.49 60.83,19.97 60.83,44.74 60.36,45.06 IC1.26
DIO21  (via drill 0.35)
  Top 0.203: IC1.31 60.36,54.46 60.61,54.71 60.61,62.39 69.85,71.63 90.42,71.63 102.62,59.44 102.62,55.12 102.87,54.86 v102.87,53.59
  Bottom 0.203: 109.22,31.27 109.22,31.24 | 109.22,31.24 J22.1 | v102.87,53.59 102.87,37.59 109.22,31.24
DIO22  (via drill 0.35)
  Top 0.203: IC1.32 59.86,54.71 60.24,55.09 60.24,63.29 70.1,73.15 91.19,73.15 104.65,59.69 104.9,59.69 v105.16,59.44
  Bottom 0.203: 109.22,40.16 109.22,40.13 | 109.22,40.13 J23.1 | v105.16,59.44 105.16,44.2 109.22,40.13
DIO23
  Top 0.203: J24.1 109.22,49.05 110.33,50.16 110.33,58.26 109.54,59.05 107.63,59.05 92.77,73.91 69.85,73.91 59.78,63.85 59.78,55.45 59.36,55.03 IC1.33
DIO24  (via drill 0.35)
  Top 0.203: IC1.35 58.36,54.72 59.35,55.71 59.35,64.18 69.6,74.42 93.47,74.42 101.6,66.29 v101.85,66.29
  Bottom 0.203: 109.22,57.78 J25.1 109.22,58.93 v101.85,66.29
DIO25  (via drill 0.35)
  Top 0.203: IC1.36 57.86,54.9 58.92,55.96 58.92,64.51 69.34,74.93 96.01,74.93 v97.03,73.91
  Bottom 0.203: v97.03,73.91 104.17,66.77 J26.1
DIO26  (via drill 0.35)
  Top 0.203: IC1.37 57.36,54.96 58.49,56.09 58.49,64.84 69.34,75.69 v93.47,75.69
  Bottom 0.203: 109.22,75.56 J27.1 109.19,75.69 v93.47,75.69
DIO27  (via drill 0.35)
  Top 0.203: v57.75,63.66 57.75,55.91 56.86,55.02 IC1.38
  Bottom 0.203: v57.75,63.66 57.75,65.56 66.61,74.42 67.82,74.42 72.39,78.99 74.68,78.99 76.49,80.8 105.57,80.8 109.22,84.45 J28.1
DIO28  (via drill 0.35)
  Top 0.203: IC1.40 55.86,53.6 56.01,54.7 56.93,55.63 56.93,64.04 73.15,80.26 v73.15,80.52 | J29.1 83.79,93.44 v82.55,92.2
  Bottom 0.203: v82.55,92.2 73.15,82.8 v73.15,80.52
DIO29  (via drill 0.35)
  Top 0.203: v75.28,81.66 73.06,81.66 56.55,65.15 56.55,55.78 55.53,54.77 55.53,54.47 55.36,53.88 IC1.41
  Bottom 0.203: v75.28,81.66 84.68,81.66 100.81,97.79 J30.1
DIO30  (via drill 0.35)
  Top 0.203: v68.26,79.22 68.26,77.69 56.07,65.5 56.07,55.98 55.05,54.96 55.05,54.51 54.86,54.08 IC1.42
  Bottom 0.203: v68.26,79.22 68.52,79.22 84.55,95.25 89.44,95.25 J31.1
DIO31  (via drill 0.35)
  Top 0.203: v55.24,58.9 55.24,55.72 54.58,55.05 54.58,54.47 54.36,54.12 IC1.43
  Bottom 0.203: v55.24,58.9 55.24,64.14 66.04,74.93 66.04,81.03 82.87,97.85 83.03,97.85 J32.1
DIO32  (via drill 0.35)
  Top 0.203: IC1.44 53.82,53.34 53.82,54.2 54.13,54.52 54.13,55.23 54.15,55.25 54.15,58.04 54.13,58.06 v54.13,59.24
  Bottom 0.203: v54.13,59.24 54.13,77.79 74.14,97.79 J33.1
DIO33  (via drill 0.35)
  Top 0.203: v53.34,58.48 53.34,58.42 53.72,58.04 53.72,54.74 53.34,54.36 53.34,53.34 IC1.45
  Bottom 0.203: v53.34,58.48 53.34,85.88 65.25,97.79 J34.1
DIO34  (via drill 0.35)
  Top 0.203: v52.39,54.93 52.39,53.34 IC1.47
  Bottom 0.203: v52.39,54.93 52.39,93.82 56.36,97.79 J35.1
DIO35  (via drill 0.35)
  Top 0.203: v51.75,55.72 51.75,54.61 51.91,54.45 51.91,53.34 IC1.48
  Bottom 0.203: v51.75,55.72 51.75,93.66 47.62,97.79 J36.1
DIO36  (via drill 0.35)
  Top 0.203: v51.12,56.52 51.12,55.4 51.28,55.24 51.28,53.34 IC1.49
  Bottom 0.203: v51.12,56.52 51.12,85.41 38.73,97.79 J37.1
DIO37  (via drill 0.35)
  Top 0.203: v50.48,55.24 50.8,54.93 50.8,53.34 IC1.50
  Bottom 0.203: v50.48,55.24 50.48,77.15 29.84,97.79 J38.1
DIO38  (via drill 0.35)
  Top 0.203: v49.85,54.29 49.85,53.34 IC1.52
  Bottom 0.203: v49.85,54.29 49.85,68.9 20.95,97.79 J39.1
DIO39  (via drill 0.35)
  Top 0.203: 49.37,53.18 IC1.53 49.36,53.8 48.99,54.17 48.99,54.54 49.36,54.92 49.36,57.32 v49.02,57.66
  Bottom 0.203: v49.02,57.66 49.02,68.07 21.59,95.5 14.26,95.5 J40.1
DIO40  (via drill 0.35)
  Top 0.203: 48.9,53.34 IC1.54 48.86,53.7 48.61,53.95 48.61,56.96 48.16,57.41 48.16,58.83 v48.26,58.93 | 5.08,89.38 J41.1
  Bottom 0.203: v48.26,58.93 48.26,61.47 20.32,89.41 5.11,89.41 J41.1
EOC1
  Top 0.203: U1.24 82.87,26.86 82.3,27.43 79.76,27.43 76.45,24.13 J1.36
EOC2  (via drill 0.35)
  Top 0.203: U2.24 61.91,75.75 v62.99,74.68
  Route2 0.203: v62.99,74.68 67.06,70.61 74.68,70.61 77.22,68.07 77.22,52.58 74.17,49.53 J1.16
EOC3
  Bottom 0.203: J1.15 45.72,49.53 41.59,53.66 U3.24
GND  (via drill 0.35)
  Top 0.203: 56.36,53.34 IC1.39 56.36,52.1 56.39,52.07 | v59.18,39.62 58.86,39.95 58.86,41.71 59.28,42.13 59.28,42.64 58.77,43.15 58.77,44.16 58.86,44.26 IC1.23 58.9,45.97 | JP1.3 v62.74,40.13 | JP2.3 v62.99,56.9 | JP3.3 v62.74,60.96 | U1.18 86.68,28.64 v86.61,28.7 | U2.18 58.1,75.37 v57.91,75.18 56.13,73.41 C1.2 | IC1.6 50.36,44.77 46.48,40.89 v44.7,40.89 | IC1.11 52.86,43.21 v51.56,41.91 | IC1.51 50.36,52.26 50.8,51.82 56.13,51.82 56.39,52.07 | IC1.34 58.86,52 58.67,51.82 56.64,51.82 | 56.64,51.82 56.39,52.07 | v56.64,51.31 56.64,51.82 | C2.2 v87.38,40.89 | JP5.3 v41.91,50.04 JP4.1
  Bottom 0.203: U3.18 38.42,57.47 v38.48,57.53 38.51,57.5 39.35,57.5 C3.2
  pour Route2: 0,102.87 114.3,102.87 114.3,0 0,0
MISO  (via drill 0.35)
  Top 0.203: U2.23 61.47,77.17 61.47,73.5 43.69,55.72 v43.69,55.63 | U1.23 83.5,27.75 83.06,28.19 83.06,33.02 83.57,33.53 v86.11,33.53
  Route2 0.203: J1.21 68.83,41.91 66.55,39.62 66.55,16 67.31,15.24 86.87,15.24 88.14,16.51 88.14,32 86.61,33.53 v86.11,33.53
  Route15 0.203: J1.21 64.26,47.5 63.47,47.5 62.99,47.02 62.36,47.02 61.88,47.5 46.48,47.5 43.69,50.29 v43.69,55.63
  Bottom 0.203: U3.23 42.35,54.29 v43.69,55.63
MOSI  (via drill 0.35)
  Top 0.203: U2.22 60.64,73.6 42.67,55.63 v42.16,55.63 | U1.22 84.14,29.15 v83.82,29.46
  Route2 0.203: J1.19 65.53,40.13 65.53,15.75 66.8,14.48 87.38,14.48 89.15,16.26 89.15,32.77 87.63,34.29 85.6,34.29 83.82,32.51 v83.82,29.46
  Route15 0.203: J1.19 64.77,49.53 48.01,49.53 46.23,51.31 46.23,56.13 45.21,57.15 43.43,57.15 42.16,55.88 v42.16,55.63
  Bottom 0.203: U3.22 41.47,54.93 v42.16,55.63
N$1
  Top 0.203: R1.2 45.53,52 44.96,52.58 41.4,52.58 40.89,52.07 JP4.2
N$2
  Bottom 0.203: U3.17 38.15,58.1 C3.1
N$3
  Top 0.203: U2.17 57.47,76.52 55.88,74.93 54.1,74.93 53.85,74.68 53.85,73.52 C1.1
N$4  (1 unrouted)
  Top 0.203: R2.2 43.3,47.5 41.15,47.5 40.89,47.75 40.89,48.27 40.54,48.62 40.54,48.77
N$11
  Top 0.203: U1.17 87.31,36.37 C2.1
N$17
  Top 0.203: JP1.2 63.75,42.42 60.86,45.31 IC1.27
N$18  (1 unrouted)
  Top 0.203: IC1.28 61.36,45.32 61.98,44.7 63.5,44.7 64.01,45.21 64.01,55.12 64.01,55.98
N$19  (1 unrouted)
  Top 0.203: IC1.29 61.36,53.95 61.61,54.21 61.61,56.79 63.75,58.93 63.75,60.05
OE
  Top 0.203: J1.11 67.56,54.61 66.55,55.63 66.55,61.21 65.79,61.98 62.23,61.98 61.11,60.86 61.11,54.46 60.86,54.21 IC1.30 60.86,50.95 58.93,49.02 46.62,49.02 R2.1
SCL  (via drill 0.35)
  Top 0.203: IC1.2 48.36,45.44 v46.86,43.94
  Route2 0.203: v46.86,43.94 51.56,43.94 64.29,56.67 64.29,57.15 64.77,57.63 65.25,57.63 J1.5
  Bottom 0.152: J1.5 69.37,62.23
  Bottom 0.203: J1.5 67.82,62.23 66.8,63.25 R4.1
SCLK  (via drill 0.35)
  Top 0.203: v41.4,56.9 57.4,72.9 58.67,72.9 59.94,74.17 59.94,74.83 60.17,75.06 60.17,75.82 59.94,76.04 59.94,77.29 U2.21 | U1.21 84.77,30.92 84.84,30.99 v84.58,30.99
  Route2 0.203: J1.23 68.33,39.37 67.31,38.35 67.31,16.51 67.82,16 83.57,16 84.84,17.27 84.84,30.73 v84.58,30.99
  Route15 0.203: J1.23 62.99,46.23 46.74,46.23 42.42,50.55 42.42,54.1 41.4,55.12 v41.4,56.9
  Bottom 0.203: U3.21 38.07,55.56 38.23,55.4 39.91,55.4 v41.4,56.9
SDA  (via drill 0.35)
  Top 0.203: v45.91,44.7 46.93,44.7 47.86,45.64 IC1.1
  Route15 0.203: J1.3 44.96,64.77 40.54,60.35 40.54,50.07 v45.91,44.7
  Bottom 0.203: J1.3 67.56,64.77 66.55,65.79 R3.1

### Text on the board
tNames: GND | GND | GND | GND | GND | GND | GND | GND | GND | GND | GND | GND | ADC32 | DIO38 | DIO30 | DIO29 | ADC31 | ADC30 | DIO37 | ADC29 | DIO36 | ADC28 | DIO35 | DIO34 | DIO33 | DIO32 | ADC23 | ADC22 | ADC21 | DIO40 | ADC27 | ADC26 | ADC25 | ADC24 | GND | DIO31 | GND | DIO27 | ADC19 | DIO1 | ADC33 | GND | 5v | ADC20-29 | DIO26 | ADC18 | GND | GND | DIO2 | ADC34 | 5v | DIO25 | ADC17 | GND | GND | DIO3 | ADC35 | DIO24 | ADC16 | 5v | GND | GND | DIO23 | DIO4 | ADC15 | ADC36 | GND | 5v | DIO22 | GND | ADC14 | DIO5 | GND | ADC37 | 5v | DIO21 | ADC13 | GND | GND | DIO6 | ADC38 | DIO20 | 5v | ADC12 | ADC1-16 | GND | GND | ADC3 | DIO7 | DIO19 | ADC40 | ADC1 | ADC2 | ADC4 | ADC5 | ADC6 | ADC7 | ADC8 | ADC9 | ADC11 | ADC39 | 5v | GND | GND | GND | GND | 5v | GND | DIO9 | DIO10 | DIO11 | GND | DIO12 | GND | DIO13 | GND | DIO14 | GND | DIO15 | GND | DIO16 | GND | DIO17 | GND
bNames: ADC33-39